# Altium schematic sheet USB.SchDoc
size C; SheetNumber: 4; SheetTotal: 9
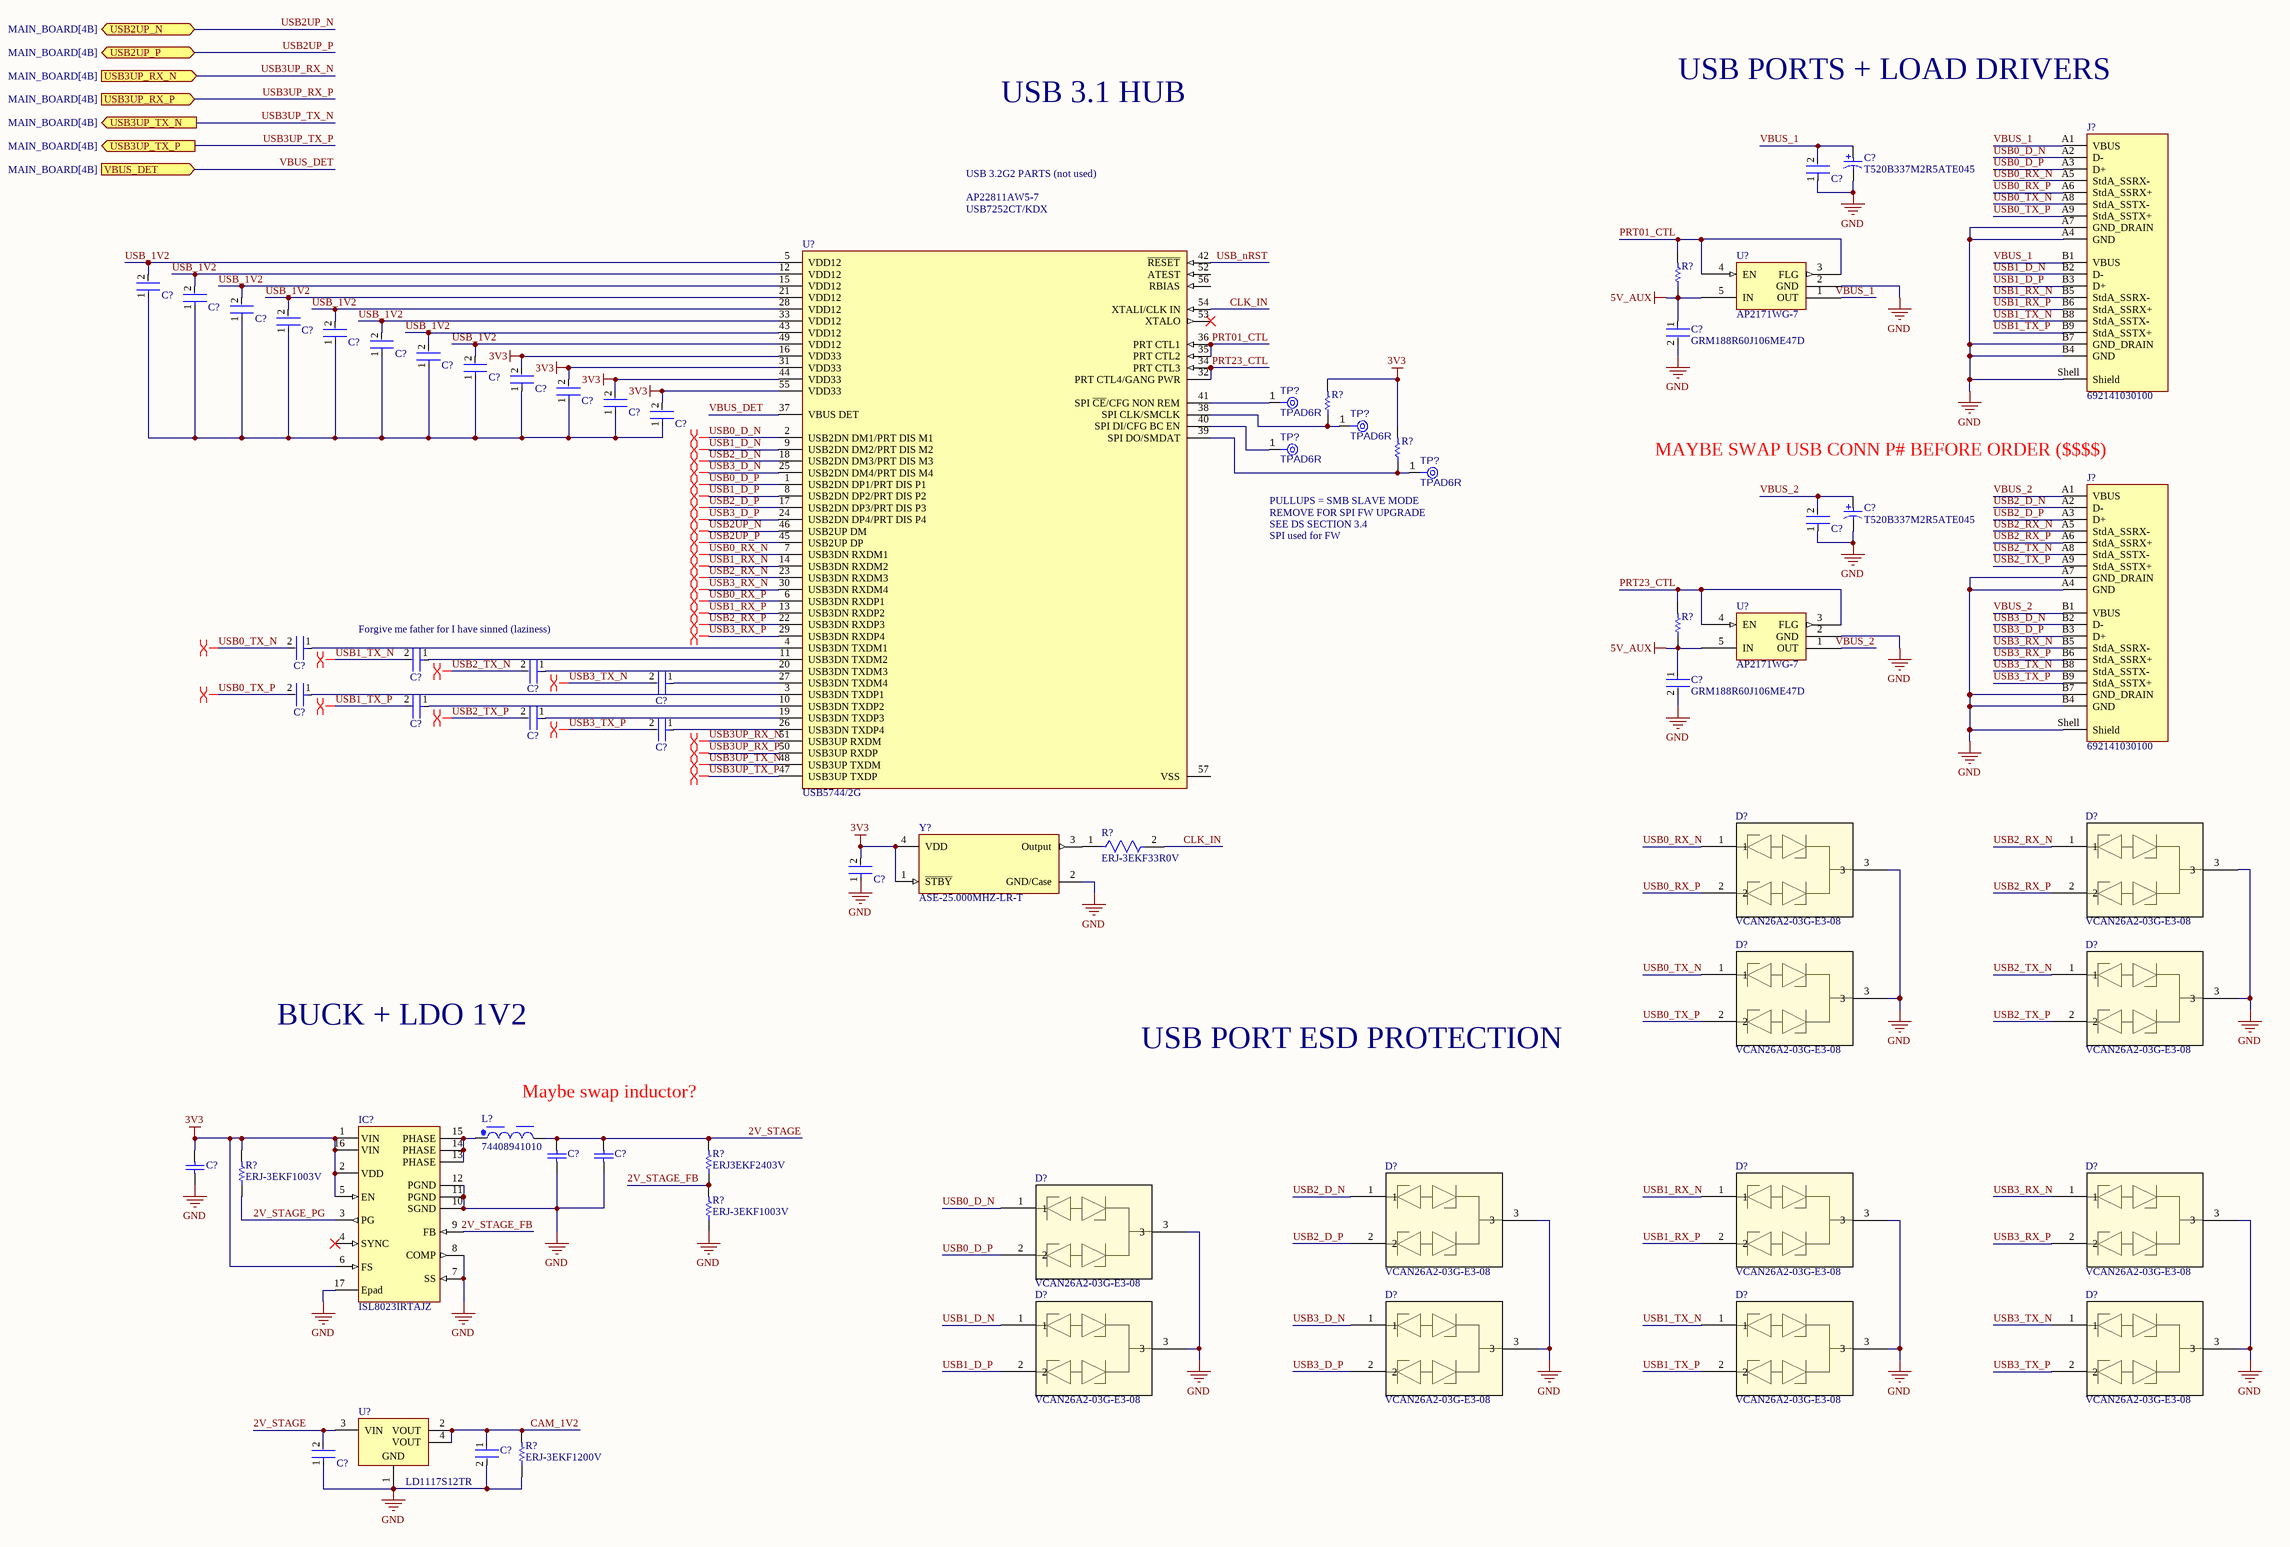
[diagram p0: USB.SchDoc]

## Parts
(Parts that share a designator on the sheet are numbered #1, #2 ... from top to bottom, then left to right.)
C?#1  T520B337M2R5ATE045  [KEMT-520-B-2_M]
C?#2  C1005X7R1H104K050BB  [FP-C1005-050-0_05-IPC_C]  (value not drawn)
C?#3  C1005X7R1H104K050BB  [FP-C1005-050-0_05-IPC_C]  (value not drawn)
C?#4  C1005X7R1H104K050BB  [FP-C1005-050-0_05-IPC_C]  (value not drawn)
C?#5  C1005X7R1H104K050BB  [FP-C1005-050-0_05-IPC_C]  (value not drawn)
C?#6  GRM188R60J106ME47D  [FP-GRM188-0_1-e0_2_0_55-IPC_A]
C?#7  C1005X7R1H104K050BB  [FP-C1005-050-0_05-IPC_C]  (value not drawn)
C?#8  C1005X7R1H104K050BB  [FP-C1005-050-0_05-IPC_C]  (value not drawn)
C?#9  C1005X7R1H104K050BB  [FP-C1005-050-0_05-IPC_C]  (value not drawn)
C?#10  C1005X7R1H104K050BB  [FP-C1005-050-0_05-IPC_C]  (value not drawn)
C?#11  C1005X7R1H104K050BB  [FP-C1005-050-0_05-IPC_C]  (value not drawn)
C?#12  C1005X7R1H104K050BB  [FP-C1005-050-0_05-IPC_C]  (value not drawn)
C?#13  C1005X7R1H104K050BB  [FP-C1005-050-0_05-IPC_C]  (value not drawn)
C?#14  C1005X7R1H104K050BB  [FP-C1005-050-0_05-IPC_C]  (value not drawn)
C?#15  C1005X7R1H104K050BB  [FP-C1005-050-0_05-IPC_C]  (value not drawn)
C?#16  T520B337M2R5ATE045  [KEMT-520-B-2_M]
C?#17  C1005X7R1H104K050BB  [FP-C1005-050-0_05-IPC_C]  (value not drawn)
C?#18  C1005X7R1H104K050BB  [FP-C1005-050-0_05-IPC_C]  (value not drawn)
C?#19  C1005X7R1H104K050BB  [FP-C1005-050-0_05-IPC_C]  (value not drawn)
C?#20  C1005X7R1H104K050BB  [FP-C1005-050-0_05-IPC_C]  (value not drawn)
C?#21  GRM188R60J106ME47D  [FP-GRM188-0_1-e0_2_0_55-IPC_A]
C?#22  C1005X7R1H104K050BB  [FP-C1005-050-0_05-IPC_C]  (value not drawn)
C?#23  C1005X7R1H104K050BB  [FP-C1005-050-0_05-IPC_C]  (value not drawn)
C?#24  C1005X7R1H104K050BB  [FP-C1005-050-0_05-IPC_C]  (value not drawn)
C?#25  C1005X7R1H104K050BB  [FP-C1005-050-0_05-IPC_C]  (value not drawn)
C?#26  C1005X7R1H104K050BB  [FP-C1005-050-0_05-IPC_C]  (value not drawn)
C?#27  C1005X7R1H104K050BB  [FP-C1005-050-0_05-IPC_C]  (value not drawn)
C?#28  C1608X5R0J226M080AC  [CAPC1608X100X20ML10]  (value not drawn)
C?#29  C1608X5R0J226M080AC  [CAPC1608X100X20ML10]  (value not drawn)
C?#30  C1608X5R0J226M080AC  [CAPC1608X100X20ML10]  (value not drawn)
C?#31  GRM188R60J106ME47D  [FP-GRM188-0_1-e0_2_0_55-IPC_A]  (value not drawn)
C?#32  C1005X7R1H104K050BB  [FP-C1005-050-0_05-IPC_C]  (value not drawn)
D?#1  VCAN26A2-03G-E3-08  [VCAN26A2-03G-E3-08-Footprint-1]
D?#2  VCAN26A2-03G-E3-08  [VCAN26A2-03G-E3-08-Footprint-1]
D?#3  VCAN26A2-03G-E3-08  [VCAN26A2-03G-E3-08-Footprint-1]
D?#4  VCAN26A2-03G-E3-08  [VCAN26A2-03G-E3-08-Footprint-1]
D?#5  VCAN26A2-03G-E3-08  [VCAN26A2-03G-E3-08-Footprint-1]
D?#6  VCAN26A2-03G-E3-08  [VCAN26A2-03G-E3-08-Footprint-1]
D?#7  VCAN26A2-03G-E3-08  [VCAN26A2-03G-E3-08-Footprint-1]
D?#8  VCAN26A2-03G-E3-08  [VCAN26A2-03G-E3-08-Footprint-1]
D?#9  VCAN26A2-03G-E3-08  [VCAN26A2-03G-E3-08-Footprint-1]
D?#10  VCAN26A2-03G-E3-08  [VCAN26A2-03G-E3-08-Footprint-1]
D?#11  VCAN26A2-03G-E3-08  [VCAN26A2-03G-E3-08-Footprint-1]
D?#12  VCAN26A2-03G-E3-08  [VCAN26A2-03G-E3-08-Footprint-1]
IC?  ISL8023IRTAJZ  [TQFN50P300X300X80_HS-17N]
J?#1  692141030100  [692141030100]
J?#2  692141030100  [692141030100]
L?  74408941010  [WE-SPC_4818]
R?#1  ERJ3EKF1002V  [RESC1609X55X30LL15T15]  (value not drawn)
R?#2  ERJ3EKF1002V  [RESC1609X55X30LL15T15]  (value not drawn)
R?#3  ERJ3EKF1002V  [RESC1609X55X30LL15T15]  (value not drawn)
R?#4  ERJ3EKF1002V  [RESC1609X55X30LL15T15]  (value not drawn)
R?#5  ERJ-3EKF33R0V  [FP-ERJ3EK-MFG]
R?#6  ERJ3EKF2403V  [RESC1608X55X30NL15T15]
R?#7  ERJ-3EKF1003V  [RESC1608X55X30ML15T15]
R?#8  ERJ-3EKF1003V  [RESC1608X55X30ML15T15]
R?#9  ERJ-3EKF1200V  [RESC1609X55X30ML15T15]
TP?#1  TPAD6R  [TP06R]  (no BOM)
TP?#2  TPAD6R  [TP06R]  (no BOM)
TP?#3  TPAD6R  [TP06R]  (no BOM)
TP?#4  TPAD6R  [TP06R]  (no BOM)
U?#1  USB5744/2G  [FP-USB5744-2G-MFG]
U?#2  AP2171WG-7  [SOT95P285X130-5N]
U?#3  AP2171WG-7  [SOT95P285X130-5N]
U?#4  LD1117S12TR  [SOT-223_M]
Y?  ASE-25.000MHZ-LR-T  [FP-ASE-MFG]

## Ports
USB2UP_N (bidir, see MAIN_BOARD[4B]), USB2UP_P (bidir, see MAIN_BOARD[4B]), USB3UP_RX_N (in, see MAIN_BOARD[4B]), USB3UP_RX_P (in, see MAIN_BOARD[4B]), USB3UP_TX_N (out, see MAIN_BOARD[4B]), USB3UP_TX_P (out, see MAIN_BOARD[4B]), VBUS_DET (in, see MAIN_BOARD[4B])

## Nets
3V3: C?#12.2 C?#13.2 C?#14.2 C?#15.2 C?#27.2 C?#30.2 IC?.1(VIN) IC?.2(VDD) IC?.5(EN) IC?.6(FS) IC?.16(VIN) R?#2.2 R?#3.2 R?#7.2 U?#1.16(VDD33) U?#1.31(VDD33) U?#1.44(VDD33) U?#1.55(VDD33) Y?.1(~{STBY}) Y?.4(VDD)
5V_AUX: C?#6.1 C?#21.1 R?#1.1 R?#4.1 U?#2.5(IN) U?#3.5(IN)
GND: C?#1.2 C?#2.1 C?#6.2 C?#16.2 C?#17.1 C?#21.2 C?#27.1 C?#28.1 C?#29.1 C?#30.1 C?#31.2 C?#32.1 D?#1.3 D?#2.3 D?#3.3 D?#4.3 D?#5.3 D?#6.3 D?#7.3 D?#8.3 D?#9.3 D?#10.3 D?#11.3 D?#12.3 IC?.7(SS) IC?.8(COMP) IC?.10(SGND) IC?.11(PGND) IC?.12(PGND) IC?.17(Epad) J?#1.A4(GND) J?#1.A7(GND_DRAIN) J?#1.B4(GND) J?#1.B7(GND_DRAIN) J?#1.Shell(Shield) J?#2.A4(GND) J?#2.A7(GND_DRAIN) J?#2.B4(GND) J?#2.B7(GND_DRAIN) J?#2.Shell(Shield) R?#8.1 R?#9.1 U?#2.2(GND) U?#3.2(GND) U?#4.1(GND) Y?.2(GND/Case)
2V_STAGE: C?#28.2 C?#29.2 C?#32.2 L?.2 R?#6.2 U?#4.3(VIN)
2V_STAGE_FB: IC?.9(FB) R?#6.1 R?#8.2
2V_STAGE_PG: IC?.3(PG) R?#7.1
CAM_1V2: C?#31.1 R?#9.2 U?#4.2(VOUT) U?#4.4(VOUT)
CLK_IN: R?#5.2 U?#1.54(XTALI/CLK_IN)
PRT01_CTL: R?#1.2 U?#1.35(PRT_CTL2) U?#1.36(PRT_CTL1) U?#2.3(FLG) U?#2.4(EN)
PRT23_CTL: R?#4.2 U?#1.32(PRT_CTL4/GANG_PWR) U?#1.34(PRT_CTL3) U?#3.3(FLG) U?#3.4(EN)
USB0_D_N: D?#8.1 J?#1.A2(D-) U?#1.2(USB2DN_DM1/PRT_DIS_M1)
USB0_D_P: D?#8.2 J?#1.A3(D+) U?#1.1(USB2DN_DP1/PRT_DIS_P1)
USB0_RX_N: D?#1.1 J?#1.A5(StdA_SSRX-) U?#1.7(USB3DN_RXDM1)
USB0_RX_P: D?#1.2 J?#1.A6(StdA_SSRX+) U?#1.6(USB3DN_RXDP1)
USB0_TX_N: C?#18.2 D?#3.1 J?#1.A8(StdA_SSTX-)
USB0_TX_P: C?#23.2 D?#3.2 J?#1.A9(StdA_SSTX+)
USB1_D_N: D?#9.1 J?#1.B2(D-) U?#1.9(USB2DN_DM2/PRT_DIS_M2)
USB1_D_P: D?#9.2 J?#1.B3(D+) U?#1.8(USB2DN_DP2/PRT_DIS_P2)
USB1_RX_N: D?#6.1 J?#1.B5(StdA_SSRX-) U?#1.14(USB3DN_RXDM2)
USB1_RX_P: D?#6.2 J?#1.B6(StdA_SSRX+) U?#1.13(USB3DN_RXDP2)
USB1_TX_N: C?#19.2 D?#11.1 J?#1.B8(StdA_SSTX-)
USB1_TX_P: C?#24.2 D?#11.2 J?#1.B9(StdA_SSTX+)
USB2_D_N: D?#5.1 J?#2.A2(D-) U?#1.18(USB2DN_DM3/PRT_DIS_M3)
USB2_D_P: D?#5.2 J?#2.A3(D+) U?#1.17(USB2DN_DP3/PRT_DIS_P3)
USB2_RX_N: D?#2.1 J?#2.A5(StdA_SSRX-) U?#1.23(USB3DN_RXDM3)
USB2_RX_P: D?#2.2 J?#2.A6(StdA_SSRX+) U?#1.22(USB3DN_RXDP3)
USB2_TX_N: C?#20.2 D?#4.1 J?#2.A8(StdA_SSTX-)
USB2_TX_P: C?#25.2 D?#4.2 J?#2.A9(StdA_SSTX+)
USB2UP_N: U?#1.46(USB2UP_DM) ; port USB2UP_N
USB2UP_P: U?#1.45(USB2UP_DP) ; port USB2UP_P
USB3_D_N: D?#10.1 J?#2.B2(D-) U?#1.25(USB2DN_DM4/PRT_DIS_M4)
USB3_D_P: D?#10.2 J?#2.B3(D+) U?#1.24(USB2DN_DP4/PRT_DIS_P4)
USB3_RX_N: D?#7.1 J?#2.B5(StdA_SSRX-) U?#1.30(USB3DN_RXDM4)
USB3_RX_P: D?#7.2 J?#2.B6(StdA_SSRX+) U?#1.29(USB3DN_RXDP4)
USB3_TX_N: C?#22.2 D?#12.1 J?#2.B8(StdA_SSTX-)
USB3_TX_P: C?#26.2 D?#12.2 J?#2.B9(StdA_SSTX+)
USB3UP_RX_N: U?#1.51(USB3UP_RXDM) ; port USB3UP_RX_N
USB3UP_RX_P: U?#1.50(USB3UP_RXDP) ; port USB3UP_RX_P
USB3UP_TX_N: U?#1.48(USB3UP_TXDM) ; port USB3UP_TX_N
USB3UP_TX_P: U?#1.47(USB3UP_TXDP) ; port USB3UP_TX_P
USB_1V2: C?#3.2 C?#4.2 C?#5.2 C?#7.2 C?#8.2 C?#9.2 C?#10.2 C?#11.2 U?#1.5(VDD12) U?#1.12(VDD12) U?#1.15(VDD12) U?#1.21(VDD12) U?#1.28(VDD12) U?#1.33(VDD12) U?#1.43(VDD12) U?#1.49(VDD12)
USB_nRST: U?#1.42(~{RESET})
VBUS_1: C?#1.1 C?#2.2 J?#1.A1(VBUS) J?#1.B1(VBUS) U?#2.1(OUT)
VBUS_2: C?#16.1 C?#17.2 J?#2.A1(VBUS) J?#2.B1(VBUS) U?#3.1(OUT)
VBUS_DET: U?#1.37(VBUS_DET) ; port VBUS_DET
NetC?#3_1: C?#3.1 C?#4.1 C?#5.1 C?#7.1 C?#8.1 C?#9.1 C?#10.1 C?#11.1 C?#12.1 C?#13.1 C?#14.1 C?#15.1
NetC?#18_1: C?#18.1 U?#1.4(USB3DN_TXDM1)
NetC?#19_1: C?#19.1 U?#1.11(USB3DN_TXDM2)
NetC?#20_1: C?#20.1 U?#1.20(USB3DN_TXDM3)
NetC?#22_1: C?#22.1 U?#1.27(USB3DN_TXDM4)
NetC?#23_1: C?#23.1 U?#1.3(USB3DN_TXDP1)
NetC?#24_1: C?#24.1 U?#1.10(USB3DN_TXDP2)
NetC?#25_1: C?#25.1 U?#1.19(USB3DN_TXDP3)
NetC?#26_1: C?#26.1 U?#1.26(USB3DN_TXDP4)
NetIC?_13: IC?.13(PHASE) IC?.14(PHASE) IC?.15(PHASE) L?.1
NetR?#2_1: R?#2.1 TP?#2.1(TP) U?#1.38(SPI_CLK/SMCLK)
NetR?#3_1: R?#3.1 TP?#4.1(TP) U?#1.39(SPI_DO/SMDAT)
NetR?#5_1: R?#5.1 Y?.3(Output)
NetTP?#1_1: TP?#1.1(TP) U?#1.41(SPI_~{CE}/CFG_NON_REM)
NetTP?#3_1: TP?#3.1(TP) U?#1.40(SPI_DI/CFG_BC_EN)

Not connected (* = marked no-connect by the designer): IC? 4(SYNC)*; U?#1 52(ATEST) 53(XTALO)* 56(RBIAS) 57(VSS)

## Layout directives
differential pair: USB0_D_N, USB0_D_P, USB0_RX_N, USB0_RX_P, USB0_TX_N, USB0_TX_P, USB1_D_N, USB1_D_P, USB1_RX_N, USB1_RX_P, USB1_TX_N, USB1_TX_P, USB2_D_N, USB2_D_P, USB2_RX_N, USB2_RX_P, USB2_TX_N, USB2_TX_P, USB2UP_N, USB2UP_P, USB3_D_N, USB3_D_P, USB3_RX_N, USB3_RX_P, USB3_TX_N, USB3_TX_P, USB3UP_RX_N, USB3UP_RX_P, USB3UP_TX_N, USB3UP_TX_P

## Notes on the sheet
- USB 3.1 HUB
- USB PORTS + LOAD DRIVERS
- AP22811AW5-7
- USB7252CT/KDX
- USB 3.2G2 PARTS (not used)
- MAYBE SWAP USB CONN P# BEFORE ORDER ($$$$)
- PULLUPS = SMB SLAVE MODE
- REMOVE FOR SPI FW UPGRADE
- SPI used for FW
- SEE DS SECTION 3.4
- (near C?#19) Forgive me father for I have sinned (laziness)
- BUCK + LDO 1V2
- Maybe swap inductor?
- USB PORT ESD PROTECTION

## Library data of the parts
C?#1 C?#16 = CMP-1664-00002-2: Tantalum Capacitor, 330 uF, +/- 20%, 2.5 V, -55 to 105 degC, 2-Pin Molded, RoHS, Tape and Reel; Capacitance: 330 uF; PartNumber: T520B337M2R5ATE045; DatasheetVersion: 07/2016; Radiation Hardening: No; ComponentLink2Description: Datasheet; PackageDescription: 2-Pin Surface Mount Device, Body 3.5 x 2.8 mm; Width: 2.8 mm; ComponentLink2URL: http://capacitoredge.kemet.com/capedge2/DataSheet?pn=T520B337M2R5ATE045; Case/Package: 1411; Length: 3.5 mm; Package Quantity: 2000; Max Operating Temperature: 105 degC; Mounting Technology: Surface Mount; Height: 2.1 mm; RoHSCompliant: True; ComponentLink1URL: http://www.kemet.com/; Mount: Surface Mount; Packaging: Tape and Reel; ComponentLink1Description: Manufacturer URL; Min Operating Temperature: -55 degC
C?#2-C?#5 C?#7-C?#15 C?#17-C?#20 C?#22-C?#27 C?#32 = CMP-2000-05393-2: Multilayer Ceramic Capacitors 100nF ±10% 50V X7R SMD 0402; Voltage: 50V; Dielectric Material: Ceramic; Min Operating Temperature: -55°C; Depth: 0.5mm; Radiation Hardening: No; RoHS Compliant: Yes; Voltage Rating (DC): 50V; Lead Free: Lead Free; Resistor Type: Ceramic; Height: 0.5mm; Dielectric: X7R; Thickness: 0.022inch; Case/Package: 0402; Case Code (Metric): 1005; Termination: SMD/SMT; Capacitance: 100nF; Packaging: Tape and Reel; Max Operating Temperature: 125°C; Mount: Surface Mount; Package Quantity: 1; Width: 0.02inch; Weight: 2.3E-05oz; Voltage Rating: 50V; Tolerance: 10%; Construction: Flat; Case Code (Imperial): 0402; Length: 1mm; REACH SVHC: No SVHC; Series: C
C?#6 C?#21 C?#31 = CMP-2006-02792-2: Chip Multilayer Ceramic Capacitors for General Purpose, 0603, 10uF, X5R, 15%, 20%, 6.3V; Packaging: Tape and Reel; Voltage Rating (DC): 6.3V; Width: 0.031inch; Termination: SMD/SMT; Dielectric: X5R; Package Quantity: 4000; Voltage Rating: 6.3V; Capacitance: 10uF; Case/Package: 0603; Min Operating Temperature: -55°C; Voltage: 6.3V; Length: 1.6mm; Thickness: 0.035inch; Lead Free: Lead Free; Depth: 0.8mm; Case Code (Imperial): 0603; Max Operating Temperature: 85°C; Material: Ceramic; Height: 0.8mm; Tolerance: 20%; Mount: Surface Mount; REACH SVHC: No SVHC; Radiation Hardening: No; Case Code (Metric): 1608
C?#28-C?#30 = CMP-2000-05440-1: Chip Capacitor, 22 uF, +/- 20%, 6.3 V, -55 to 85 degC, 1608 (0603 Metric), RoHS, Tape and Reel; PCN Part Number: MLCCPartNumberChange30/Nov/2012; Manufacturer: TDK; Temperature Coefficient: X5R; Product Training Modules: CSeriesGeneralApplicationsSEAT,CCV,andTVCLDesignToolsGuidetoReplacinganElectrolyticCapacitorwithanMLCC; Other Names: 445-8028-1; Capacitance: 22µF; Voltage - Rated: 6.3V; Design Resources: 20WNon-IsolatedBuckLEDDriverUsingPLLNK460KG; Online Catalog: CSeries,GeneralPurpose; Kits: 445-9003-KIT-ND-KITCAPCERHICAPMLCCSMD; Tolerance: ±20%; Series: C; Thickness (Max): 0.039"(1.00mm); Mounting Type: SurfaceMount,MLCC; Ratings: -; Datasheet Version: Mar-15; Package Reference: 603; Packaging: CutTape(CT); Features: -; Package / Case: 0603(1608Metric); Family: CeramicCapacitors; Lead Spacing: -; RoHS Information: RoHSCertificate-MLCC; Manufacturer URL: http://www.tdk.com/; Lead Style: -; Category: Capacitors; Applications: GeneralPurpose; Package Description: 2-Pin Surface Mount Device, Body 1.6 x 0.8 mm; Standard Package: 1; Datasheet URL: http://www.farnell.com/datasheets/1913358.pdf; Height - Seated (Max): -; Operating Temperature: -55degC~85degC; Size / Dimension: 0.063"Lx0.031"W(1.60mmx0.80mm)
D?#1-D?#12 = CMP-004-00042-1: ESD Suppressor Diode TVS Bi-Dir 26.5V 3-Pin SOT-323 T/R
IC? = CMP-00572-88252977-1: ISL8023IRTAJZ Conv DC-DC Single Step Down 2.7V to 5.5V 16-Pin QFN EP; Output Current: 3A; NexarPartId: 88252977; Output Voltage: 5.5V
J?#1 J?#2 = CMP-1502-03222-3: NexarPartId: 19667819; Connector Type: USB; Contact Resistance: 50mΩ; USB Standard: USB 3.0; Insulation Resistance: 100MΩ; Number of Contacts: 18; Gender: Receptacle; Number of Ports: 2; Voltage Rating (AC): 30V; Current Rating: 1.8A; Min Operating Temperature: -40°C; Max Operating Temperature: 85°C; Lead Free: Lead Free; Features: Shielded; Width: 19.7mm; Length: 15.59mm; Flammability Rating: UL94 V-0; Contact Plating: Gold; RoHS: Compliant; Number of Pins: 18; Termination: Through Hole; Contact Material: Bronze, Gold, Nickel; Mount: Horizontal, Through Hole; Voltage Rating: 30V; Operating Supply Voltage: 30V; REACH SVHC: Unknown; Orientation: Right Angle; Color: Blue; Height: 16.335mm
L? = CMP-1401-00006-2: NexarPartId: 23392449; Current Rating: 3A; DC Resistance (DCR): 25mΩ; Inductance: 1µH; Core Material: Ferrite; Self Resonant Frequency: 100MHz; Inductance Tolerance: 20%; Number of Pins: 2; Length: 4.8mm; Width: 4.8mm; Min Operating Temperature: -40°C; Packaging: Tape & Reel (TR); RoHS: Compliant; Height: 1.8mm; Ambient Temperature Range High: 85°C; Max Operating Temperature: 125°C; Ambient Temperature Range Low: -40°C
R?#1-R?#4 = CMP-1012-00623-3: Chip Resistor, 10 KOhm, +/- 1%, 0.1 W, -55 to 155 degC, 0603 (1608 Metric), RoHS, Tape and Reel; Manufacturer: Panasonic; Voltage Rating: 75V; Case\/Package: 0603; Power Rating: 100mW; Resistance: 10KOhm; Temperature Coefficient: 100ppm\/degreesC; Number of Pins: 2; Package Reference: 603; Depth: 0.8mm; Mount: SurfaceMount; Package Description: 2-Pin Surface Mount Device, Body 1.6 x 0.85 mm; Datasheet Version: 02/2017; Length: 1.6mm; Lead Free: LeadFree; Height: 0.45mm; Number of Terminations: 2; Max Power Dissipation: 100mW; Min Operating Temperature: -55degC; Datasheet URL: https://industrial.panasonic.com/cdbs/www-data/pdf/RDA0000/AOA0000C304.pdf; Termination: SMD/SMT; Case Code (Metric): 1608; Case Code (Imperial): 0603; Tolerance: 1%; Max Operating Temperature: 155degC; RoHSCompliant: true; Voltage Rating (DC): 75V; Radiation Hardening: No; Packaging: TapeandReel; Composition: ThickFilm; Mounting Technology: SurfaceMount; Manufacturer URL: http://www.panasonic.com/; Width: 0.031inch; REACH SVHC: NoSVHC; Contact Plating: Tin; Military Standard: Not; Package Quantity: 1
R?#5 = CMP-2000-00443-2: RES SMD 33 OHM 1% 1/10W 0603; Voltage Rating (DC): 75V; Power Rating: 100mW; Resistance: 33R; Temperature Coefficient: 100ppm/°C; Min Operating Temperature: -55°C; Packaging: Tape and Reel; Mount: Surface Mount; Lead Free: Lead Free; Voltage Rating: 75V; Features: Automotive AEC-Q200; Height: 0.022inch; Width: 0.031inch; Number of Pins: 2; Package Quantity: 1; Case Code (Metric): 1608; Max Power Dissipation: 100mW; Case Code (Imperial): 0603; Termination: SMD/SMT; Resistance Tolerance: 1%; Max Operating Temperature: 155°C; Tolerance: 1%; Length: 1.6mm; Case/Package: 0603; Military Standard: Not; RoHS Compliant: Yes; Series: ERJ; Size Code: 0603; Construction: Rectangular; Number of Terminations: 2; Radiation Hardening: No; Resistor Type: Thick Film; Contact Plating: Tin; Depth: 0.8mm; REACH SVHC: No SVHC
R?#6 = CMP-2000-00363-1: Manufacturer: Panasonic; Part Number: ERJ3EKF2403V
R?#7 R?#8 = CMP-2000-00182-1: Manufacturer: Panasonic; Part Number: ERJ-3EKF1003V
R?#9 = CMP-2000-00213-2: Chip Resistor, 120 Ohm, +/- 1%, 0.1 W, -55 to 155 degC, 0603 (1608 Metric), RoHS, Tape and Reel; Manufacturer: Panasonic; Power Rating: 100mW; Voltage Rating (DC): 75V; Resistance: 120Ohm; Temperature Coefficient: 100ppm/degreesC; Number of Terminations: 2; Military Standard: Not; Tolerance: 1%; Min Operating Temperature: -55degC; Packaging: TapeandReel; Lead Free: LeadFree; Max Operating Temperature: 155degC; Manufacturer URL: http://www.panasonic.com/; Case Code (Imperial): 0603; REACH SVHC: NoSVHC; Width: 0.031inch; Datasheet URL: https://industrial.panasonic.com/cdbs/www-data/pdf/RDA0000/AOA0000C283.pdf; RoHSCompliant: true; Max Power Dissipation: 100mW; Termination: SMD/SMT; Package Reference: 0603; Height: 0.022inch; Depth: 0.8mm; Package Description: 2-Pin Surface Mount Device, Body 1.6 x 0.85 mm; Contact Plating: Tin; Length: 1.6mm; Package URL: http://www.st.com/st-web-ui/static/active/en/resource/technical/document/datasheet/CD00001320.pdf; Radiation Hardening: No; Package Quantity: 1; Number of Pins: 2; Datasheet Version: 42095.0; Voltage Rating: 75V; Composition: ThickFilm; Case/Package: 0603; Mount: SurfaceMount; Case Code (Metric): 1608
TP?#1-TP?#4 = CMP-00028-00002-2: 0.6mm round; Pins: 1
U?#1 = CMP-06284-000017-1: IC HUB CTLR USB 56VQFN; Min Operating Temperature: 0°C; Packaging: Tray; Lead Free: Lead Free; Interface: USB; Max Operating Temperature: 70°C
U?#2 U?#3 = CMP-019-00057-1: IC PWR SW USB 1CH 1A SOT-25-5
U?#4 = CMP-0244-00318-1: Fixed Low Drop Positive Voltage Regulator, 1.2V, 4-Pin SOT-223, Tape and Reel; PackageDescription: 4-Pin SOT-223 Package, 6.5 x 3.5 mm Body, 2.3 mm Pitch, 7 mm Lead Span; PackageVersion: 2010; ComponentLink2Description: Datasheet; PackageReference: SOT-223; ComponentLink2URL: http://www.st.com/internet/com/TECHNICAL_RESOURCES/TECHNICAL_LITERATURE/DATASHEET/CD00000544.pdf; ComponentLink1Description: Manufacturer URL; DatasheetVersion: 1/11/2011; ComponentLink1URL: http://www.st.com
Y? = CMP-27762-000357-1: XTAL Oscillator 25MHz ±25ppm CMOS 3.3V 4-SMD 3.2mm x 2.5mm; Min Supply Voltage: 3.135V; Max Supply Current: 13mA; Max Supply Voltage: 3.465V; Load Capacitance: 15pF; Height: 0.047inch; Series: ASE; Frequency Stability: 25ppm; Mount: Surface Mount; Case/Package: SMD/SMT; Width: 0.098inch; Operating Frequency: 25 MHz; REACH SVHC: No SVHC; Package Quantity: 1000; Number of Pins: 4; Termination: SMD/SMT; Frequency: 25MHz; Max Operating Temperature: 85°C; Packaging: Tape and Reel; Min Operating Temperature: -40°C; Lead Free: Lead Free; Length: 0.126inch; Operating Supply Voltage: 3.3V